# Altium project Embebidos.PrjPcb
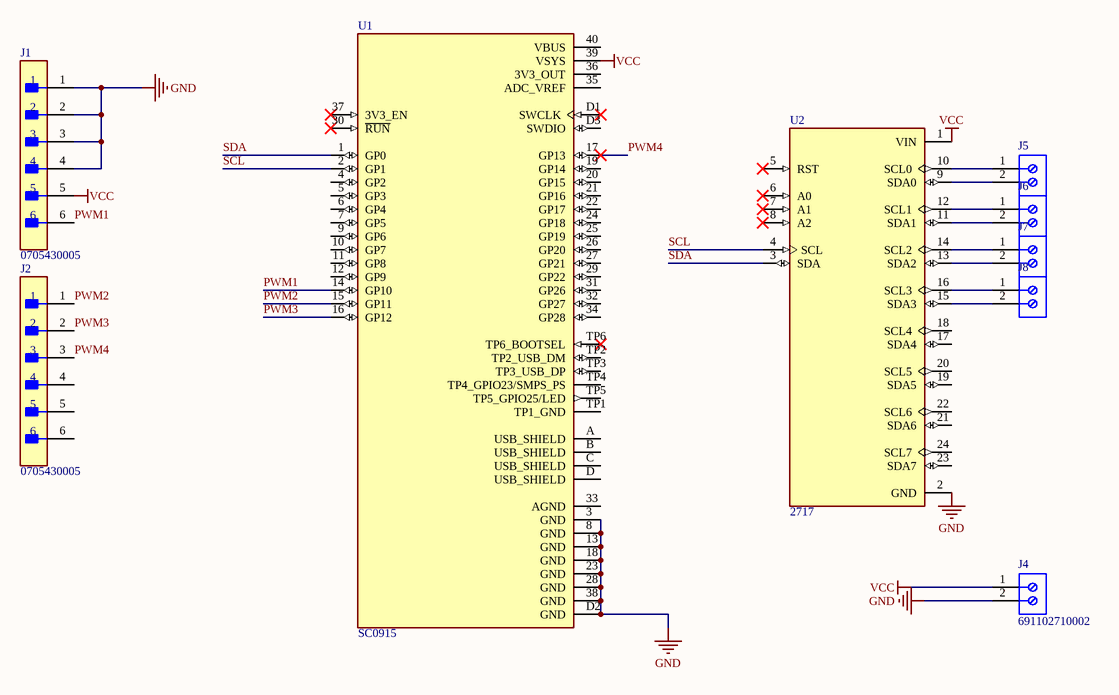
[diagram p0: Robot.SchDoc]
1 sheet, 9 parts. Net scope: global (net labels, ports and power ports of the same name join across sheets).
Board file: PCB1.PcbDoc

## Sheet Robot.SchDoc
size A4; SheetNumber: 1; SheetTotal: 1

### Parts
J1  0705430005  [FP-0705430005-MFG]
J2  0705430005  [FP-0705430005-MFG]
J4  691102710002  [691102710002]
J5  691102710002  [691102710002]  (value not drawn)
J6  691102710002  [691102710002]  (value not drawn)
J7  691102710002  [691102710002]  (value not drawn)
J8  691102710002  [691102710002]  (value not drawn)
U1  SC0915  [MODULE_SC0915]
U2  2717  [MODULE_2717]

### Nets
GND: J1.1 J1.2 J1.3 J1.4 J4.2 U1.3(GND) U1.8(GND) U1.13(GND) U1.18(GND) U1.23(GND) U1.28(GND) U1.38(GND) U1.D2(GND) U2.2(GND)
VCC: J1.5 J4.1 U1.39(VSYS) U2.1(VIN)
PWM1: J1.6 U1.14(GP10)
PWM2: J2.1 U1.15(GP11)
PWM3: J2.2 U1.16(GP12)
PWM4: J2.3 U1.17(GP13)
SCL: U1.2(GP1) U2.4(SCL)
SDA: U1.1(GP0) U2.3(SDA)
NetJ5_1: J5.1 U2.10(SCL0)
NetJ5_2: J5.2 U2.9(SDA0)
NetJ6_1: J6.1 U2.12(SCL1)
NetJ6_2: J6.2 U2.11(SDA1)
NetJ7_1: J7.1 U2.14(SCL2)
NetJ7_2: J7.2 U2.13(SDA2)
NetJ8_1: J8.1 U2.16(SCL3)
NetJ8_2: J8.2 U2.15(SDA3)

Not connected (* = marked no-connect by the designer): J2 4 5 6; U1 4(GP2) 5(GP3) 6(GP4) 7(GP5) 9(GP6) 10(GP7) 11(GP8) 12(GP9) 19(GP14) 20(GP15) 21(GP16) 22(GP17) 24(GP18) 25(GP19) 26(GP20) 27(GP21) 29(GP22) 30(~{RUN})* 31(GP26) 32(GP27) 33(AGND) 34(GP28) 35(ADC_VREF) 36(3V3_OUT) 37(3V3_EN)* 40(VBUS) A(USB_SHIELD) B(USB_SHIELD) C(USB_SHIELD) D(USB_SHIELD) D1(SWCLK)* D3(SWDIO) TP1(TP1_GND) TP2(TP2_USB_DM) TP3(TP3_USB_DP) TP4(TP4_GPIO23/SMPS_PS) TP5(TP5_GPIO25/LED) TP6(TP6_BOOTSEL)*; U2 5(RST)* 6(A0)* 7(A1)* 8(A2)* 17(SDA4) 18(SCL4) 19(SDA5) 20(SCL5) 21(SDA6) 22(SCL6) 23(SDA7) 24(SCL7)

### Library data of the parts
J1 J2 = CMP-04776-000067-1: CONN HEADER VERT 6POS 2.54MM; Manufacturer: Molex; Conn Orientation: Vertical; Standoff Height: 0.25mm; Description: Conn Shrouded Header HDR 6 POS 2.54mm Solder ST Thru-Hole SL™ Tube; Voltage Rating: 250V; Number Of Contacts: 6; Current Rating: 3A; Conn Gender: Male; ComponentLink2URL: https://www.molex.com/webdocs/datasheets/pdf/en-us/0705430005_PCB_HEADERS.pdf; Digikey Description: CONN HEADER VERT 6POS 2.54MM; Pitch: 2.54mm; Temperature Range High: +105°C; Octopart: https://octopart.com/70543-0005-molex-12981; ComponentLink2Description: Datasheet; Package: 0; Temperature Range Low: -40°C; RoHS: TRUE; Mouser Description: Connector Shrouded Header 6 Position 2.54mm Solder Straight Thru-Hole Tube; Contact Material: Gold,Tin; Footprint Url: https://www.molex.com/pdm_docs/sd/705430005_sd.pdf; Automotive: No; Device Class L2: Headers and Wire Housings; Manufacturer Part Number: 0705430005; Number Of Rows: 1; Temperature: -40°C to +105°C; Height: 11.56mm; Device Class L1: Connectors; Category: Conn; Device Class L3: unset; Lead Free: Yes
J4-J8 = CMP-1502-03258-2: NexarPartId: 8917706; Number of Levels: 1; Number of Positions Per Level: 2; Current: 15A; Voltage: 300V; Pitch: 5.0038mm; Plating: Steel; Stripping Length: -6mm; Wire Gauge (Min): 14AWG; Wire Gauge (Max): 22AWG; Length: 7.5mm; Contact Material: Brass; Contact Plating: Tin; Packaging: Box; Number of Pins: 2; Voltage Rating: 300V; Termination: Screw; Number of Contacts: 2; Color: Blue; Current Rating: 15A; Mount: Through Hole; Max Operating Temperature: 105°C; Min Operating Temperature: -40°C; REACH SVHC: Unknown; Height: 13.4mm; Width: 11.2mm; Housing Material: Nylon; RoHS: Compliant; Wire/Cable Gauge: 22AWG; Lead Pitch: 5mm
U1 = CMP-023-000000-1: RP2040 Raspberry Pi Pico series ARMÂ® CortexÂ®-M0+ MCU 32-Bit Embedded Evaluation Board; Check_prices: https://www.snapeda.com/parts/SC0915/Raspberry+Pi/view-part/?ref=eda; Component Type: Standard; Purchase-URL: https://pricing.snapeda.com/search/part/SC0915/?ref=eda; MP: SC0915; Design Item ID: SC0915; Price: None; MF: Raspberry Pi; Package: None; Source: SC0915.SchLib; Value: *; Availability: In Stock; Pin Count: 53; SnapEDA_Link: https://www.snapeda.com/parts/SC0915/Raspberry+Pi/view-part/?ref=snap
U2 = CMP-025-000000-1: Module: multiplexer; I2C interface multiplexer; TCA9548A; 3Ã·5VDC; MF: Adafruit; Check_prices: https://www.snapeda.com/parts/2717/Adafruit+Industries+LLC/view-part/?ref=eda; Source: 2717.SchLib; Value: *; Component Type: Standard; Pin Count: 24; Availability: In Stock; Design Item ID: 2717; Purchase-URL: https://pricing.snapeda.com/search/part/2717/?ref=eda; SnapEDA_Link: https://www.snapeda.com/parts/2717/Adafruit+Industries+LLC/view-part/?ref=snap; Package: None; MP: 2717; Price: None